# EAGLE design Adafruit Feather 32u4 Bluefruit LE (EAGLE 6.6.0)
COMPANY: ADAFRUIT INDUSTRIES; DRAWN: KTOWN; REV: B
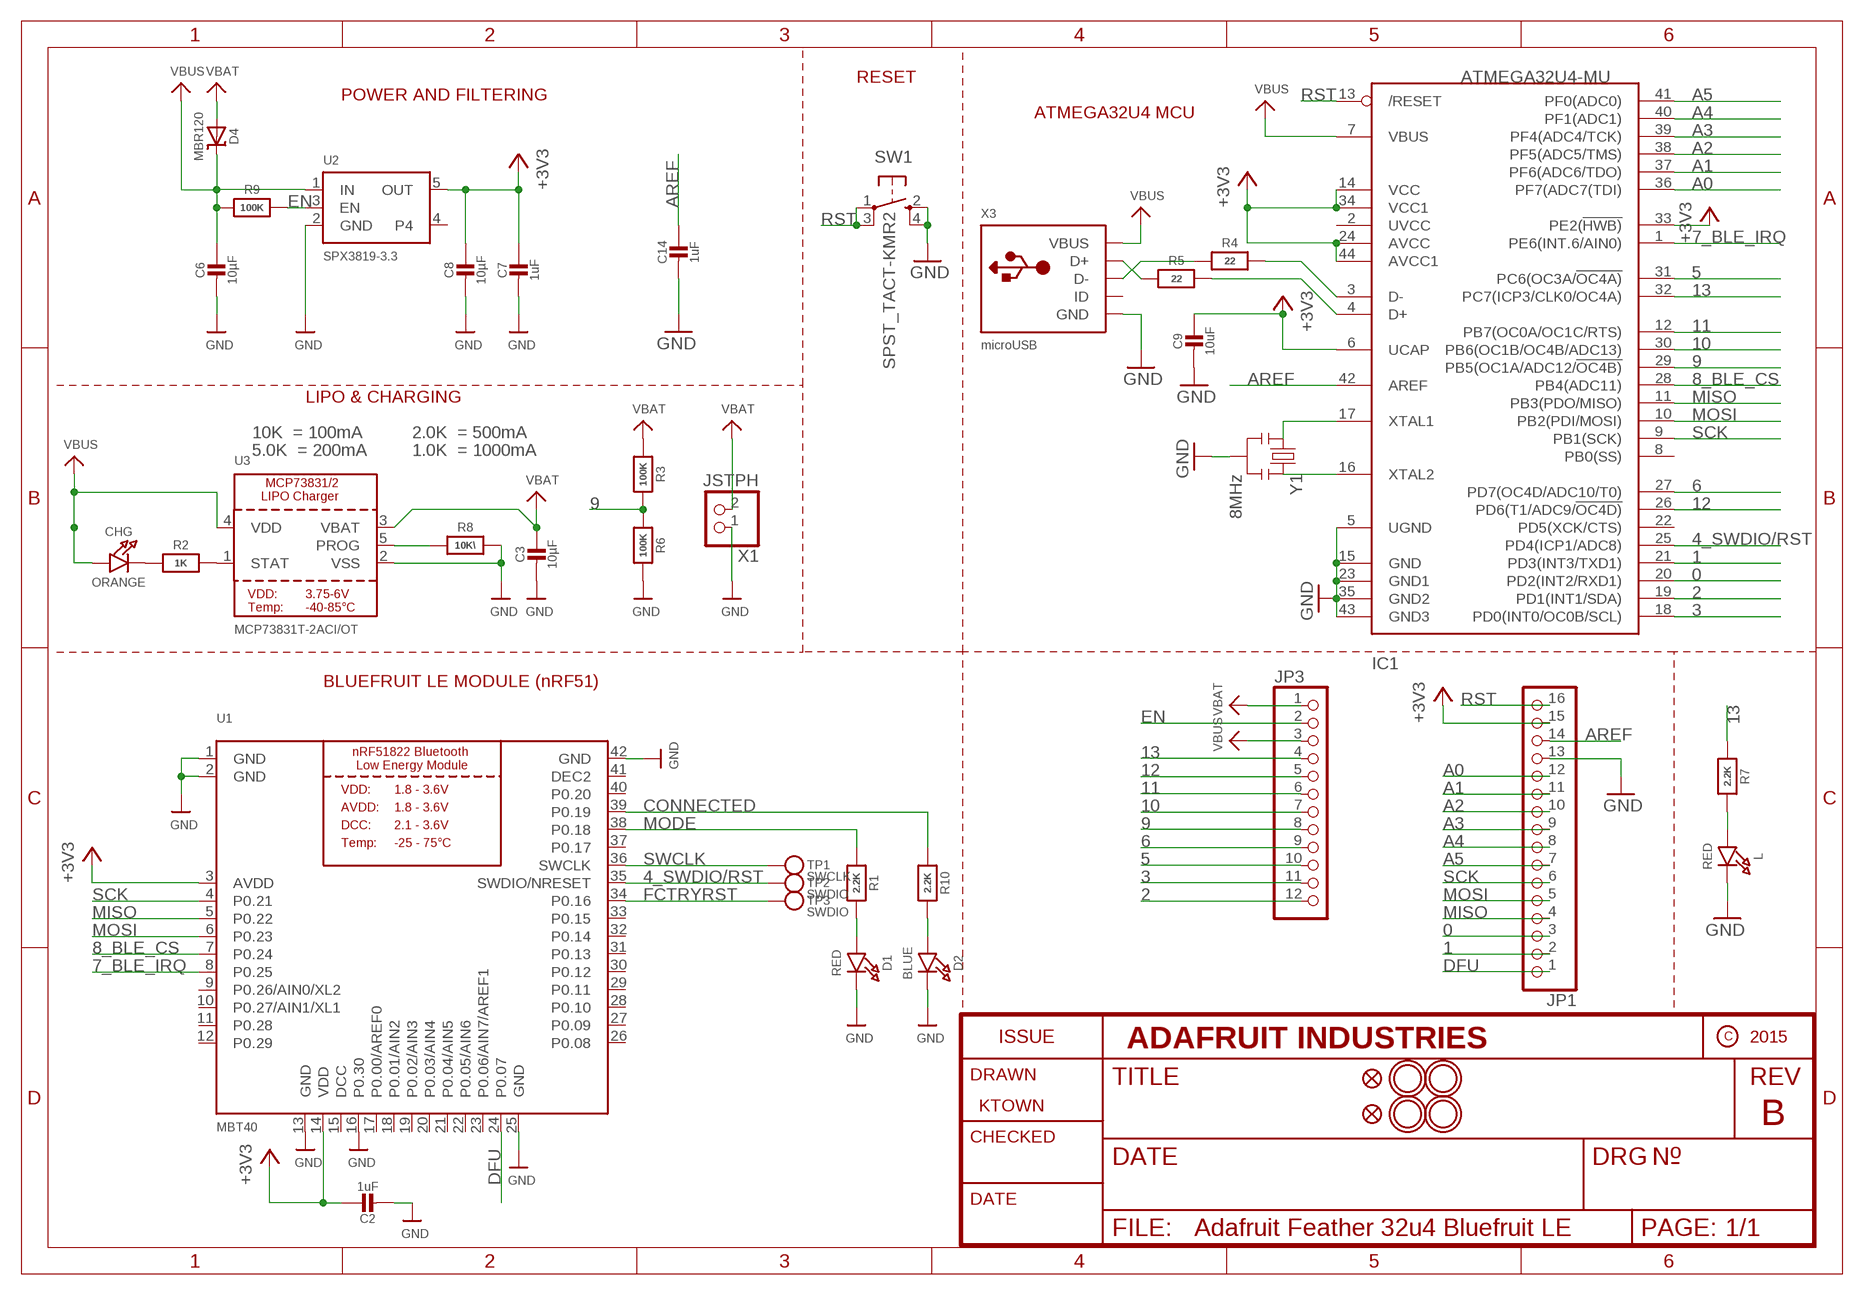
[diagram p0: schematic, sheet 1]

## Parts
C2  1uF  CAP_CERAMIC0603_NO  [0603-NO]
C3  10µF  CAP_CERAMIC0805-NOOUTLINE  [0805-NO]
C6  10µF  CAP_CERAMIC0805-NOOUTLINE  [0805-NO]
C7  1uF  CAP_CERAMIC0603_NO  [0603-NO]
C8  10µF  CAP_CERAMIC0805-NOOUTLINE  [0805-NO]
C9  10uF  CAP_CERAMIC_0805MP  [_0805MP]
C14  1uF  CAP_CERAMIC0603_NO  [0603-NO]
CHG  ORANGE  LED0805_NOOUTLINE  [CHIPLED_0805_NOOUTLINE]
D1  RED  LED0805_NOOUTLINE  [CHIPLED_0805_NOOUTLINE]
D2  BLUE  LED0805_NOOUTLINE  [CHIPLED_0805_NOOUTLINE]
D4  MBR120  DIODE-SCHOTTKYSOD-123  [SOD-123]
IC1  ATMEGA32U4-MU  [TQFN44_7MM]
JP1  HEADER-1X16ROUND  [1X16_ROUND]
JP3  HEADER-1X12  [1X12_ROUND]
L  RED  LED0805_NOOUTLINE  [CHIPLED_0805_NOOUTLINE]
R1  2.2K  RESISTOR_0603_NOOUT  [0603-NO]
R2  1K  RESISTOR_0603_NOOUT  [0603-NO]
R3  100K  RESISTOR_0603_NOOUT  [0603-NO]
R4  22  RESISTOR_0603_NOOUT  [0603-NO]
R5  22  RESISTOR_0603_NOOUT  [0603-NO]
R6  100K  RESISTOR_0603_NOOUT  [0603-NO]
R7  2.2K  RESISTOR_0603_NOOUT  [0603-NO]
R8  10K\  RESISTOR_0603_NOOUT  [0603-NO]
R9  100K  RESISTOR_0603_NOOUT  [0603-NO]
R10  2.2K  RESISTOR_0603_NOOUT  [0603-NO]
SW1  SPST_TACT-KMR2  [KMR2]
TP1  SWCLK  TESTPOINT1.5X2.0MM_NOCREAM  [PAD-1.5X2.0]
TP2  SWDIO  TESTPOINT1.5X2.0MM_NOCREAM  [PAD-1.5X2.0]
TP3  SWDIO  TESTPOINT1.5X2.0MM_NOCREAM  [PAD-1.5X2.0]
U1  MBT40  NRF51822_MODULE_MDBT40  [BLE_MODULE_RAYTAC_MDBT40]
U2  SPX3819-3.3  VREG_SOT23-5  [SOT23-5]
U3  MCP73831T-2ACI/OT  MCP73831/2  [SOT23-5]
U$6  MOUNTINGHOLE2.5  [MOUNTINGHOLE_2.5_PLATED]
U$24  MOUNTINGHOLE2.5  [MOUNTINGHOLE_2.5_PLATED]
U$31  MOUNTINGHOLE2.5  [MOUNTINGHOLE_2.5_PLATED]
U$32  MOUNTINGHOLE2.5  [MOUNTINGHOLE_2.5_PLATED]
U$34  FIDUCIAL""  [FIDUCIAL_1MM]
U$35  FIDUCIAL""  [FIDUCIAL_1MM]
X1  JSTPH  CON_JST_PH_2PIN  [JSTPH2]
X3  microUSB  USB_MICRO_20329_V2  [4UCONN_20329_V2]
Y1  8MHz  RESONATORSMD  [RESONATOR-SMD]

## Nets
0: IC1.20(PD2(INT2/RXD1)) JP1.3
1: IC1.21(PD3(INT3/TXD1)) JP1.2
2: IC1.19(PD1(INT1/SDA)) JP3.12
3: IC1.18(PD0(INT0/OC0B/SCL)) JP3.11
4_SWDIO/RST: IC1.25(PD4(ICP1/ADC8)) TP2.P$1 U1.35(SWDIO/NRESET)
5: IC1.31(PC6(OC3A/!OC4A)) JP3.10
6: IC1.27(PD7(OC4D/ADC10/T0)) JP3.9
7_BLE_IRQ: IC1.1(PE6(INT.6/AIN0)) U1.8(P0.25)
8_BLE_CS: IC1.28(PB4(ADC11)) U1.7(P0.24)
9: IC1.29(PB5(OC1A/ADC12/!OC4B)) JP3.8 R3.2 R6.1
10: IC1.30(PB6(OC1B/OC4B/ADC13)) JP3.7
11: IC1.12(PB7(OC0A/OC1C/RTS)) JP3.6
12: IC1.26(PD6(T1/ADC9/!OC4D)) JP3.5
13: IC1.32(PC7(ICP3/CLK0/OC4A)) JP3.4 R7.1
+3V3: C2.1 C7.1 C8.1 C9.1 IC1.6(UCAP) IC1.14(VCC) IC1.24(AVCC) IC1.33(PE2(!HWB)) IC1.34(VCC1) IC1.44(AVCC1) JP1.15 U1.3(AVDD) U1.14(VDD) U2.5(OUT)
A0: IC1.36(PF7(ADC7(TDI)) JP1.12
A1: IC1.37(PF6(ADC6/TDO)) JP1.11
A2: IC1.38(PF5(ADC5/TMS)) JP1.10
A3: IC1.39(PF4(ADC4/TCK)) JP1.9
A4: IC1.40(PF1(ADC1)) JP1.8
A5: IC1.41(PF0(ADC0)) JP1.7
AREF: C14.1 IC1.42(AREF) JP1.14
CONNECTED: R10.1 U1.39(P0.19)
D+: IC1.4(D+) R5.2
D-: IC1.3(D-) R4.2
DFU: JP1.1 U1.24(P0.07)
EN: JP3.2 R9.2 U2.3(EN)
FCTRYRST: TP3.P$1 U1.34(P0.16)
GND: C2.2 C3.2 C6.2 C7.2 C8.2 C9.2 C14.2 D1.C D2.C IC1.5(UGND) IC1.15(GND) IC1.23(GND1) IC1.35(GND2) IC1.43(GND3) JP1.13 L.C R6.2 R8.2 SW1.2(S) SW1.4(S1) U1.1(GND) U1.2(GND) U1.13(GND) U1.16(P0.30) U1.25(GND) U1.42(GND) U2.2(GND) U3.2(VSS) X1.1 X3.BASE@1(GND) X3.BASE@2(GND) X3.GND X3.SPRT@1(GND) X3.SPRT@2(GND) X3.SPRT@3(GND) X3.SPRT@4(GND) Y1.2
MISO: IC1.11(PB3(PDO/MISO)) JP1.4 U1.5(P0.22)
MODE: R1.1 U1.38(P0.18)
MOSI: IC1.10(PB2(PDI/MOSI)) JP1.5 U1.6(P0.23)
N$1: CHG.C R2.1
N$2: L.A R7.2
N$3: R2.2 U3.1(STAT)
N$4: R8.1 U3.5(PROG)
N$5: D1.A R1.2
N$6: D2.A R10.2
N$11: IC1.16(XTAL2) Y1.3
N$12: IC1.17(XTAL1) Y1.1
N$15: R5.1 X3.D+
N$16: R4.1 X3.D-
RST: IC1.13(/RESET) JP1.16 SW1.1(P) SW1.3(P1)
SCK: IC1.9(PB1(SCK)) JP1.6 U1.4(P0.21)
SWCLK: TP1.P$1 U1.36(SWCLK)
VBAT: C3.1 D4.A JP3.1 R3.1 U3.3(VBAT) X1.2
VBUS: C6.1 CHG.A D4.C IC1.7(VBUS) JP3.3 R9.1 U2.1(IN) U3.4(VDD) X3.VBUS
Unconnected: IC1.2(UVCC) IC1.8(PB0(SS)) IC1.22(PD5(XCK/CTS)) U1.9(P0.26/AIN0/XL2) U1.10(P0.27/AIN1/XL1) U1.11(P0.28) U1.12(P0.29) U1.17(P0.00/AREF0) U1.18(P0.01/AIN2) U1.19(P0.02/AIN3) U1.20(P0.03/AIN4) U1.21(P0.04/AIN5) U1.22(P0.05/AIN6) U1.23(P0.06/AIN7/AREF1) U1.26(P0.08) U1.27(P0.09) U1.28(P0.10) U1.29(P0.11) U1.30(P0.12) U1.31(P0.13) U1.32(P0.14) U1.33(P0.15) U1.37(P0.17) U1.40(P0.20) U2.4 X3.ID

## Notes on the sheet
- RESET
- POWER AND FILTERING
- ATMEGA32U4 MCU
- LIPO & CHARGING
- 10K  = 100mA | 2.0K  = 500mA
- 5.0K  = 200mA | 1.0K  = 1000mA
- BLUEFRUIT LE MODULE (nRF51)

## Power pins joined to a net without a drawn wire
DCC: U1.15(DCC)
DEC2: U1.41(DEC2)

## Library data of the parts
C2 C3 C6-C9 C14 = microbuilder:CAP_CERAMIC: Ceramic Capacitors For new designs, use the packages preceded by an '_' character since they are more reliable: The following footprints should be used on most boards: _0402 - Standard footprint for regular board layouts _0603 - Standard footprint for regular board layouts _0805 - Standard footprint for regular board layouts _1206 - Standard footprint for regular board layouts For extremely tight-pitch boards where space is at a premium, the following 'micro-pitch' footprints can be used (smaller pads, no silkscreen outline, etc.): _0402MP - Micro-pitch footprint for very dense/compact boards _0603MP - Micro-pitch footprint for very dense/compact boards _0805MP - Micro-pitch footprint for very dense/compact boards _1206MP - Micro-pitch footprint for very dense/compact boards
CHG D1 D2 L = microbuilder:LED: LED 0603 - 0603 Surface Mount Package 2mA: Green LED - Low Power (3.9mcd, 2ma, 1.7Vf) - Digikey: 475-2709-2-ND Orange LED - Low Power (9.8mcd, 2ma, 1.8Vf) - Digikey: 475-1194-2-ND Red LED - Low Power (5mcd, 2ma, 1.8Vf) - Digikey: 475-1195-2-ND Yellow LED - Low Power (7mcd, 2ma, 1.8Vf) - Digikey: 475-1196-2-ND 5mA: Blue LED - Low Power (17mcd, 5ma, 2.9Vf) - Digikey: LNJ937W8CRACT-ND 0805 - 0805 Surface Mount Package 2mA: Red LED (8.8mcd, 2mA, 1.8Vf, Clear) - Low Power [Digikey: 475-2510-1-ND] Green LED (5mcd, 2mA, 1.8Vf, Clear) - Low Power [Digikey: 475-2730-1-ND] Yellow LED (11.3mcd, 2mA, 1.8Vf, Clear) - Low Power [Digikey: 475-2555-1-ND] 20mA: Red LED (104mcd, 20mA, Diffused) - LS R976 [Digikey: 475-1278-6-ND] Red LED (12mcd, 20mA, 2.0Vf, Clear) - APT2012EC [Digikey: 754-1128-1-ND] Green LED (15mcd, 20mA, 2.2Vf, Clear) - APT2012GC [Digikey: 754-1131-1-ND] Orange LED (160mcd, 20mA, 2.1Vf, Clear) - APT2012SECK [Digikey: 754-1130-1-ND] 1206 - 1206 Surface Mount Package Green LED (26mcd, 20mA, Diffused) - LG N971 [Digikey: 475-1407-6-ND] Red LED (15mcd, 20mA, Diffused) - LH N974 [Digikey: 475-1416-6-ND] Cree - Cree High-Power Surface Mount LEDs XPEBWT-L1-0000-00D50 - White 111lm 350mA 2.9Vf 6200K 110° XTEAWT-00-0000-00000LEE3 - White 114lm 350mA 2.85Vf 5000K 115° Everlight - Everlight 45-21 Series Surface Mount LEDs 45-21/QK2C-B2832AC2CB2/2T - Warm White 2000mcd 20mA 3.25Vf 3050K 120° 45-21/LK2C-B38452C4CB2/2T - Nuetral White 2000mcd 20mA 3.25Vf 4150K 120° 45-21/LK2C-B50634C6CB2/2T - Cold White 2200mcd 20mA 3.25Vf 5650K 120° PLCC2 Reverse Mount LS T77K-J1L2-1-0-2-R18-Z - Red 11.25mcd 2mA 1.8Vf 630nm 120° LO T77K-L1M2-24-Z - Orange 19.6mcd 2mA 1.8Vf 606nm 120° LY T77K-K2M1-26-Z - Yellow 15.7mcd 2mA 1.8Vf 587nm 120°
D4 = microbuilder:DIODE-SCHOTTKY
IC1 = microbuilder:ATMEGA32U4: http://www.ladyada.net/library/eagle
JP1 = microbuilder:HEADER-1X16: PIN HEADER
JP3 = microbuilder:HEADER-1X12
R1-R10 = microbuilder:RESISTOR: Resistors For new designs, use the packages preceded by an '_' character since they are more reliable: The following footprints should be used on most boards: _0402 - Standard footprint for regular board layouts _0603 - Standard footprint for regular board layouts _0805 - Standard footprint for regular board layouts _1206 - Standard footprint for regular board layouts For extremely tight-pitch boards where space is at a premium, the following 'micro-pitch' footprints can be used (smaller pads, no silkscreen outline, etc.): _0402MP - Micro-pitch footprint for very dense/compact boards _0603MP - Micro-pitch footprint for very dense/compact boards _0805MP - Micro-pitch footprint for very dense/compact boards _1206MP - Micro-pitch footprint for very dense/compact boards
SW1 = adafruit:SPST_TACT: SMT 6mm switch, EVQQ2 series http://www.ladyada.net/library/eagle
TP1-TP3 = microbuilder:TESTPOINT: Test Point Various test points for characterisation and PCB testing TESTPOINT_SMT - Compact Surface Mount Test Point [Digikey: 5016KTR-ND]
U1 = microbuilder:NRF51822_MODULE_MDBT40: nRF51822 Bluetooth Low Energy Module
U2 = microbuilder:VREG_SOT23-5: SOT23-5 Fixed Voltage Regulators Part Current Out V Out V In V Dropout θJA (°C/W) TJ (°C) Digikey Part No. ADP121 150mA 3.3V 3.4-5.5V 0.09V @ 150mA -- -- ADP121-AUJZ33R7CT-ND ADP121 150mA 3.0V 3.1-5.5V 0.09V @ 150mA -- -- ADP121-AUJZ30R7CT-ND ADP122 300mA 3.3V 3.4-5.5V 0.085V @ 300mA -- -- ADP122AUJZ-3.3-R7CT-ND ADP1712 300mA 3.3V 3.5-5.5V 0.17V @ 300mA -- -- ADP1712AUJZ-3.3-R7TR-ND AP7311 (Low Cost) 150mA 3.3V 3.5-6V 0.15V @ 150mA -- -- AP7311-33WG-7DICT-ND LD39015M18R 150mA 1.8V 1.9V-5.5V 0.08V @ 100mA -- -- 497-6977-1-ND LP2985A-33DBVR 150mA 3.3V 3.3-16V 0.28V @ 150mA 206 150 296-18479-1-ND MCP1824T-3302E/OT 300mA 3.3V 3.5V-6V 0.2V @ 300mA -- -- MCP1824T-3302E/OTCT-ND MIC5205-2.5YM5 TR 150mA 2.5V 2.7-16V 0.165V @ 150mA -- -- 576-1257-2-ND MIC5205-3.0YM5 TR 150mA 3.0V 3.2V-16V 0.165V @ 150mA -- -- 576-1258-2-ND MIC5205-3.3YM5 TR 150mA 3.3V 3.5V-16V 0.165V @ 150mA -- -- 576-1259-2-ND TPS780330220 150mA 3.3V+2.2V 3.6-5.5V 250mV Max -- -- 296-23332-1-ND TDA3663/N1,135 100mA 3.3V 3.5-45V 0.18V @ 50mA -- -- 568-5343-1-ND Max operating temp can be calculated using θJA, TJ (max junction temperature), and power in watts. Set the "Maximum Ambient Temperature" until it reaches TJ ("Max Junction Temperature"), which is the absolute limit for safe use of the regulator: Heat Sink Temperature Calculator <http://www.daycounter.com/Calculators/Heat-Sink-Temperature-Calculator.phtml> For example, With 12V source into a 3.3V LP2985 and a 30mA load, we are dissipating (12V-3.3V) * 0.03A = 0.261W. With a θJA of 206 °C/W, a TJ of 150°C, and 261mW we can safely use the chip without a heat sink up to 75°C (=147.1°C Junction Temperature).
U3 = microbuilder:MCP73831/2: MCP73831/2 LIPO Charger VDD: 3.75 - 6V Temp -40 - 85°C Programmable Charge Rate: 15-500mA NOTE: STAT is a tri-state logic output on the MCP73831 and an open-drain output on the MCP73832. SOT23-5 with 4.2V output and tri-state logic on STAT = MCP73831T-2ACI/OT
U$6 U$24 U$31 U$32 = microbuilder:MOUNTINGHOLE: Mounting Hole For #2 screws (0.086"/2.18mm width, 0.094"/2.4mm hole) use 2.5mm; BOM: EXCLUDE
U$34 U$35 = microbuilder:FIDUCIAL: Fiducial Alignment Points Various fiducial points for machine vision alignment.; BOM: EXCLUDE
X1 = microbuilder:CON_JST_PH_2PIN: JST 2-Pin Right-Angle Connector PH-Series - 4UConnector: 17311 SH-Series - 4UConnector: 07278
X3 = microbuilder:USB: USB Connectors USBMINIB - Surface Mount Female Mini-B USB Connector 4UConnector: 06564
Y1 = SparkFun:RESONATOR: Resonator Small SMD resonator. This is the itty bitty 10/20MHz resonators with built in caps. CSTCE10M0G55 and CSTCE20M0V53. Footprint has been reviewed closely but hasn't been tested yet.

## Board
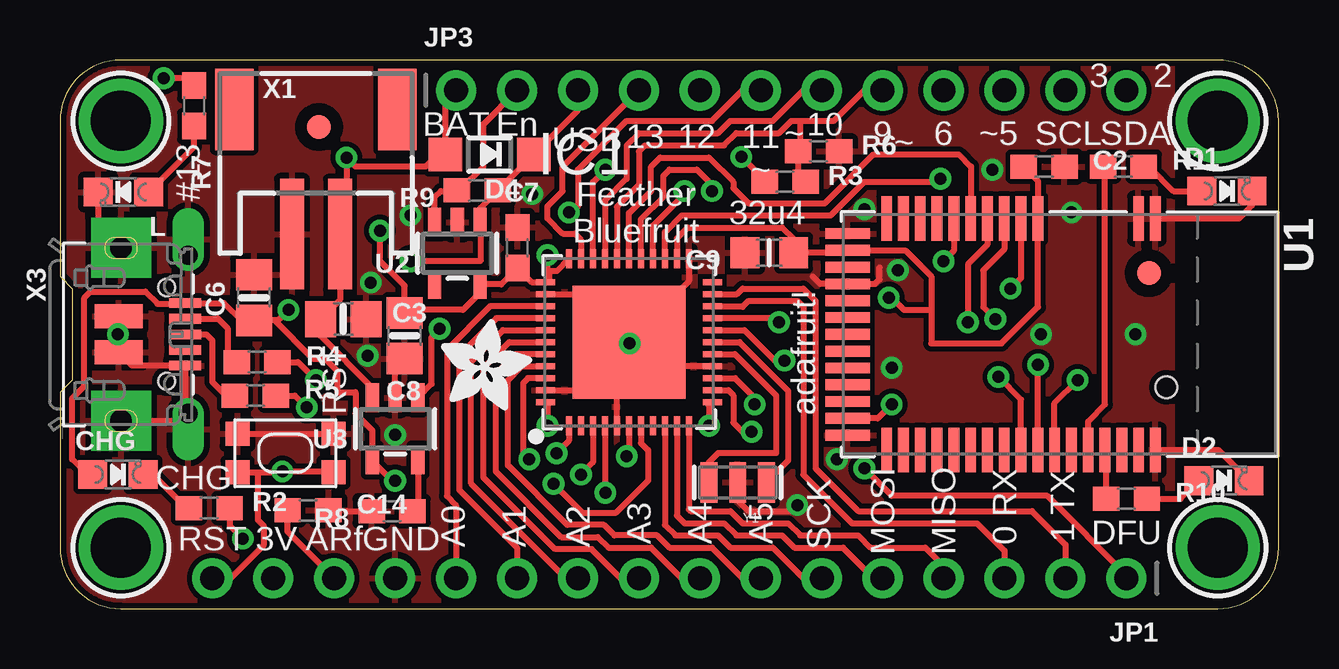
[diagram p1: board, top side]
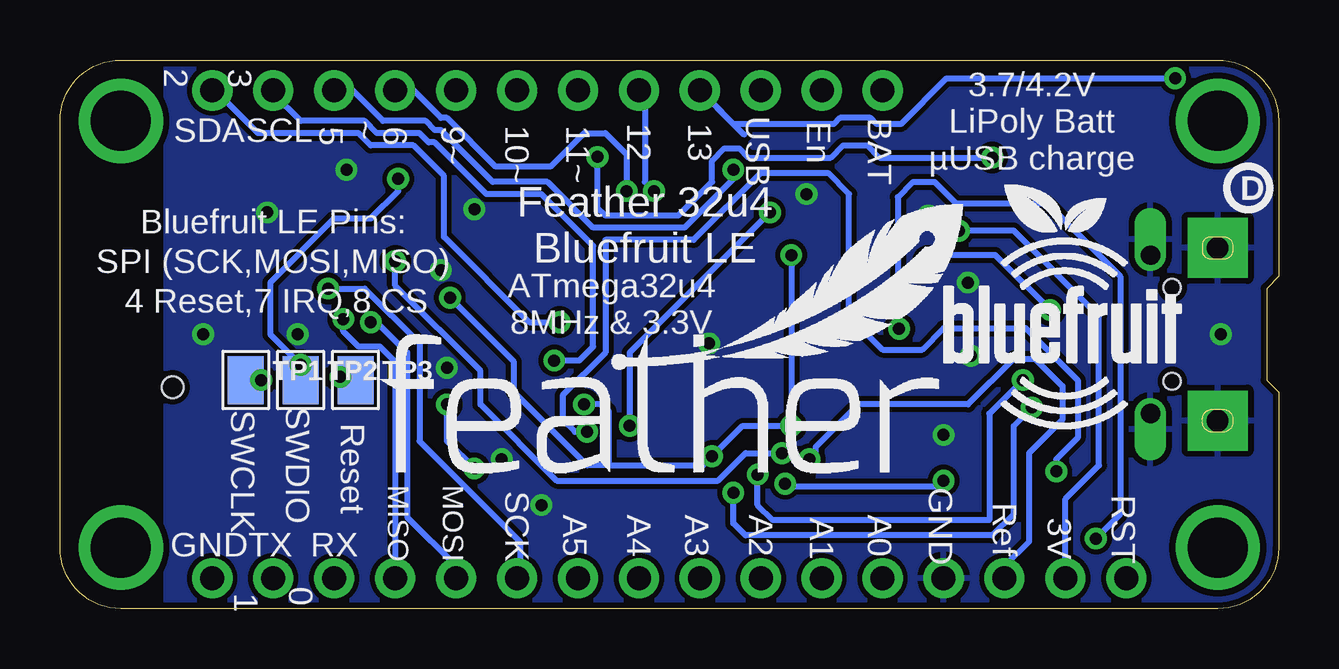
[diagram p2: board, bottom side, seen from below]

Size 50.8 x 22.86 mm. Coordinates in mm from the lower left corner, seen from the top.
Outline: 2.54,0 48.26,0 arc90 50.8,2.54 50.8,20.32 arc90 48.26,22.86 2.54,22.86 arc90 0,20.32 0,13.84 0.51,13.34 0.51,9.53 0,9.02 0,2.54 arc90 2.54,0
Copper layers (1*16): Top 0.035mm / dielectric 1.5mm / Bottom 0.035mm
Design rules "adafruit *": minimum track width 8mil, minimum drill 15.5mil, track to track 8mil, track to pad 8mil, pad to pad 8mil, via to via 8mil, smd to smd 8mil, copper to edge 10mil, drill to drill 8mil, minimum pad ring 10mil, minimum via ring 8mil, stop-mask expansion 2mil, vias tented up to drill 20mil, thermal gap 10mil
tRestrict: area 23.4,8.3 to 26.5,8.6; area 26.2,8.4 to 26.7,9.9; area 21.2,13.6 to 25.9,14.1; area 20.8,13.3 to 21.2,13.7; area 20.7,9.3 to 21.2,13; area 20.7,8.1 to 21.2,8.9; area 21.1,8.1 to 23,8.6; area 26.2,10.3 to 26.7,13.3

### Footprints (pad centres in the part's own frame; a part is rotated, then mirrored left to right if it is on the bottom)
0603-NO = smd 1.1 x 1: 1 -0.85,0; 2 0.85,0
0805-NO = smd 1.3 x 1.5: 1 -0.95,0; 2 0.95,0
_0805MP = smd 1.2 x 1.3: 1 -1.016,0; 2 1.016,0
CHIPLED_0805_NOOUTLINE = smd 1.2 x 1.2: A 0,-1.05; C 0,1.05
SOD-123 = smd 1.4 x 1.4: A 1.85,0; C -1.85,0
TQFN44_7MM = smd 0.25 x 0.8: 1 -2.5,-3.475; 2 -2,-3.475; 3 -1.5,-3.475; 4 -1,-3.475; 5 -0.5,-3.475; 6 0,-3.475; 7 0.5,-3.475; 8 1,-3.475; 9 1.5,-3.475; 10 2,-3.475; 11 2.5,-3.475; 23 2.5,3.475; 24 2,3.475; 25 1.5,3.475; 26 1,3.475; 27 0.5,3.475; 28 0,3.475; 29 -0.5,3.475; 30 -1,3.475; 31 -1.5,3.475; 32 -2,3.475; 33 -2.5,3.475 | smd 0.8 x 0.25: 12 3.475,-2.5; 13 3.475,-2; 14 3.475,-1.5; 15 3.475,-1; 16 3.475,-0.5; 17 3.475,0; 18 3.475,0.5; 19 3.475,1; 20 3.475,1.5; 21 3.475,2; 22 3.475,2.5; 34 -3.475,2.5; 35 -3.475,2; 36 -3.475,1.5; 37 -3.475,1; 38 -3.475,0.5; 39 -3.475,0; 40 -3.475,-0.5; 41 -3.475,-1; 42 -3.475,-1.5; 43 -3.475,-2; 44 -3.475,-2.5 | smd 4.7 x 4.7: THERMAL 0,0
1X16_ROUND = drill 1 pad 1.676: 1 -19.05,0; 2 -16.51,0; 3 -13.97,0; 4 -11.43,0; 5 -8.89,0; 6 -6.35,0; 7 -3.81,0; 8 -1.27,0; 9 1.27,0; 10 3.81,0; 11 6.35,0; 12 8.89,0; 13 11.43,0; 14 13.97,0; 15 16.51,0; 16 19.05,0
1X12_ROUND = drill 1 pad 1.676: 1 -13.97,0; 2 -11.43,0; 3 -8.89,0; 4 -6.35,0; 5 -3.81,0; 6 -1.27,0; 7 1.27,0; 8 3.81,0; 9 6.35,0; 10 8.89,0; 11 11.43,0; 12 13.97,0
KMR2 = smd 1 x 1: 1 2,0.8; 2 2,-0.8; 3 -2,0.8; 4 -2,-0.8
PAD-1.5X2.0 = smd 1.5 x 2: P$1 0,0
BLE_MODULE_RAYTAC_MDBT40 = smd 1.85 x 0.45: 1 -4.825,4; 2 -4.825,3.3; 3 -4.825,-0.9; 4 -4.825,-1.6; 5 -4.825,-2.3; 6 -4.825,-3; 7 -4.825,-3.7; 8 -4.825,-4.4; 9 -4.825,-5.1; 10 -4.825,-5.8; 11 -4.825,-6.5; 12 -4.825,-7.2; 26 4.825,-7.2; 27 4.825,-6.5; 28 4.825,-5.8; 29 4.825,-5.1; 30 4.825,-4.4; 31 4.825,-3.7; 32 4.825,-3; 33 4.825,-2.3; 34 4.825,-1.6; 35 4.825,-0.9; 36 4.825,-0.2; 37 4.825,0.5; 38 4.825,1.2; 39 4.825,1.9; 40 4.825,2.6; 41 4.825,3.3; 42 4.825,4 | smd 0.45 x 1.85: 13 -4.2,-8.825; 14 -3.5,-8.825; 15 -2.8,-8.825; 16 -2.1,-8.825; 17 -1.4,-8.825; 18 -0.7,-8.825; 19 0,-8.825; 20 0.7,-8.825; 21 1.4,-8.825; 22 2.1,-8.825; 23 2.8,-8.825; 24 3.5,-8.825; 25 4.2,-8.825 | hole 0.9: 2.2,4.45
SOT23-5 = smd 0.55 x 1.2: 1 -0.95,-1.3; 2 0,-1.3; 3 0.95,-1.3; 4 0.95,1.3; 5 -0.95,1.3
MOUNTINGHOLE_2.5_PLATED = drill 2.5 pad 3.2: P$1 0,0
FIDUCIAL_1MM = smd 1 x 1: 1 0,0
JSTPH2 = smd 1 x 4.6: 1 -1,-3.7; 2 1,-3.7 | smd 1.6 x 3.4: NC1 -3.4,1.5; NC2 3.4,1.5
4UCONN_20329_V2 = smd 1 x 2: BASE@1 -0.75,-2; BASE@2 0.75,-2 | smd 0.4 x 1.35: D+ 0,0.775; D- -0.65,0.775; GND 1.3,0.775; ID 0.65,0.775; VBUS -1.3,0.775 | drill 0.8 pad 1.2 offset: SPRT@1 -3.3,0.9; SPRT@2 3.3,0.9 | drill 0.9 pad 2.5 square: SPRT@3 -3.6,-1.9; SPRT@4 3.6,-1.9 | hole 0.7: -1.95,0; 1.95,0
RESONATOR-SMD = smd 0.7 x 1.7: 1 -1.2,0; 2 0,0; 3 1.2,0

### Placement (x,y rotation side)
C2  41.02,18.41 0 top
C3  11.81,12.06 0 top
C6  8.09,12.96 90 top
C7  19.07,15.04 90 top
C8  14.37,11.37 270 top
C9  29.57,14.83 180 top
C14  10.34,4.09 0 top
CHG  2.41,5.59 270 top
D1  48.64,17.4 270 top
D2  48.51,5.33 270 top
D4  17.91,18.92 180 top
IC1  23.72,11.1 0 top
JP1  25.4,1.27 180 top
JP3  30.48,21.59 0 top
L  2.65,17.36 90 top
R1  44.32,18.41 0 top
R2  6.22,4.19 0 top
R3  30.23,17.78 0 top
R4  8.22,10.27 0 top
R5  8.15,8.88 0 top
R6  31.62,19.05 0 top
R7  5.59,20.95 270 top
R8  13.84,4.06 180 top
R9  17.4,17.42 180 top
R10  44.45,4.57 0 top
SW1  9.4,6.48 180 top
TP1  43.05,9.53 0 bottom
TP2  40.77,9.53 0 bottom
TP3  38.48,9.53 0 bottom
U1  41.66,11.43 270 top
U2  16.56,14.81 180 top
U3  13.97,7.49 180 top
U$6  48.26,20.32 0 top
U$7  [ADAFRUIT_3.5MM]  15.88,8.26 0 top
U$9  [FEATHERLOGO]  37.47,5.59 0 bottom
U$23  [PCBFEAT-REV-040]  1.27,17.53 0 bottom
U$24  48.26,2.54 0 top
U$26  [BLUEFRUITLOGO_100MM]  13.97,7.49 0 bottom
U$31  2.54,20.32 270 top
U$32  2.54,2.54 270 top
U$34  10.79,20.07 270 top
U$35  45.39,13.98 270 top
X1  10.67,19.3 0 top
X3  4.45,11.43 270 top
Y1  28.25,5.26 180 top

### Tracks (layer width: path | path; a pad name or v marks a point on that pad's centre or on a via)
0
  Top 0.254: JP1.3 39.37,2.41 38.23,3.56 33.02,3.56 30.99,5.59 30.99,12.57 30.73,12.83 28.7,12.83 28.45,12.57 27.22,12.57 IC1.20
1
  Top 0.254: JP1.2 41.91,2.67 40.51,4.06 33.27,4.06 31.5,5.84 31.5,12.83 30.99,13.34 28.45,13.34 28.21,13.1 IC1.21
2  (via drill 0.5)
  Top 0.254: IC1.19 29.75,12.1 29.92,11.94 v29.97,11.94
  Bottom 0.254: 43.94,21.59 JP3.12 44.32,21.59 42.55,19.81 38.35,19.81 37.85,19.3 36.07,19.3 34.8,18.03 34.8,15.49 31.24,11.94 v29.97,11.94
3  (via drill 0.5)
  Top 0.254: IC1.18 28.53,11.6 29.79,10.34 v30.2,10.34
  Bottom 0.254: JP3.11 41.91,21.46 40.77,20.32 38.1,20.32 37.59,19.81 35.81,19.81 35.43,19.43 35.18,19.43 33.02,17.27 30.73,17.27 28.57,15.11 28.57,10.92 29.16,10.34 v30.2,10.34
4_SWDIO/RST  (via drill 0.5)
  Top 0.254: U1.35 40.76,10.15 v40.77,10.16 | IC1.25 25.22,15.69 25.91,16.38 32.13,16.38 33.53,17.78 36.58,17.78 v36.7,17.91
  Bottom 0.254: TP2.P$1 v40.77,10.16 42.04,11.43 42.04,13.59 39.37,16.26 37.85,16.26 36.7,17.4 v36.7,17.91
5  (via drill 0.5)
  Top 0.254: IC1.31 22.22,17.77 v22.73,18.29
  Bottom 0.254: JP3.10 39.12,21.59 | 39.5,21.59 JP3.10 | v22.73,18.29 22.73,17.91 24.77,15.88 28.57,15.88 30.48,17.78 32.77,17.78 34.92,19.94 35.18,19.94 35.56,20.32 37.34,20.32 38.61,21.59 JP3.10
6  (via drill 0.5)
  Top 0.254: IC1.27 24.22,16.22 25.15,17.14 25.15,18.03 25.4,18.29 26.54,18.29 27.18,17.65 v27.18,17.4
  Bottom 0.254: JP3.9 36.07,21.59 34.92,20.45 34.67,20.45 32.64,18.41 30.35,18.41 28.96,19.81 28.07,19.81 27.18,18.92 v27.18,17.4
7_BLE_IRQ  (via drill 0.5)
  Top 0.254: U1.8 37.26,14.9 v36.83,14.48 | IC1.1 21.22,6.99 v20.7,6.48
  Bottom 0.254: v20.7,6.48 22.23,6.48 23.37,5.33 30.1,5.33 33.27,8.51 33.27,9.91 36.83,13.46 v36.83,14.48
8_BLE_CS
  Top 0.254: IC1.28 23.72,16.48 24.64,17.4 24.64,18.41 25.02,18.8 27.05,18.8 28.07,17.78 28.07,17.53 28.7,16.89 31.88,16.89 33.91,18.92 37.47,18.92 37.97,18.41 37.97,16.27 U1.7
9
  Top 0.254: IC1.29 23.22,16.74 24.13,17.65 24.13,19.05 24.38,19.3 27.69,19.3 28.19,19.81 29.97,19.81 30.48,20.32 30.86,20.32 | 30.86,20.32 32.26,20.32 33.53,21.59 JP3.8 | R3.2 30.77,18.08 R6.1 30.86,19.14 30.86,20.32
10
  Top 0.254: JP3.7 30.99,21.59 29.72,20.32 27.94,20.32 27.43,19.81 24.13,19.81 23.62,19.3 23.62,17.91 22.72,17 IC1.30
11  (via drill 0.5)
  Top 0.254: v21.21,16.51 21.34,16.51 21.59,16.76 21.59,18.29 23.62,20.32 27.18,20.32 28.45,21.59 JP3.6 | IC1.12 27.05,8.46 v27.05,7.62
  Bottom 0.254: v21.21,16.51 27.05,10.67 v27.05,7.62
12  (via drill 0.5)
  Top 0.254: v26.04,17.4 26.16,17.4 24.72,15.96 IC1.26
  Bottom 0.254: JP3.5 26.42,21.34 26.42,17.78 v26.04,17.4
13  (via drill 0.5)
  Top 0.254: JP3.4 20.95,18.41 20.95,17.4 20.32,16.76 20.32,16.26 20.95,15.62 21.46,15.62 21.72,15.37 IC1.32 | R7.1 5.29,22.1 v4.32,22.1
  Bottom 0.254: 22.29,19.75 JP3.4 22.73,20.19 18.54,20.19 18.29,20.45 17.02,20.45 16.76,20.19 15.75,20.19 13.84,22.1 v4.32,22.1
+3V3  (via drill 0.5)
  Top 0.254: 36.32,12.45 36.32,13.84 35.23,14.93 U1.14 32.8,14.96 32.68,14.83 C9.1 30.59,15.39 30.1,15.88 26.16,15.88 25.72,15.43 IC1.24 | 36.32,12.45 36.32,11.05 39.24,11.05 40.77,12.57 40.77,15.61 40.76,15.62 U1.3 40.76,17.83 C2.1 | IC1.33 20.71,14.07 20.39,14.07 | 20.39,14.07 20.32,14.14 v20.32,14.73 | IC1.14 28.14,9.6 28.96,8.79 v28.96,8.51 | 36.32,12.45 35.18,12.45 34.67,12.95 v34.54,12.95 | 20.39,14.07 20.39,13.6 IC1.34 19.65,13.6 C7.1 18.39,13.51 U2.5 17.51,13.16 16.8,12.45 14.49,12.45 C8.1 14.37,13.45 13.34,14.48 v13.34,15.75 | IC1.44 20.32,8.53 v20.32,7.62 | IC1.6 23.72,6.45 v23.62,6.35
  Bottom 0.254: v20.32,14.73 v20.32,7.62 22.35,7.62 v23.62,6.35 24,5.97 27.94,5.97 | 27.94,5.97 27.94,8.26 28.19,8.51 v28.96,8.51 | 27.94,5.97 28.83,5.97 31.88,9.02 31.88,10.29 v34.54,12.95 | JP1.15 8.89,4.57 7.49,5.97 7.49,12.19 11.05,15.75 v13.34,15.75
A0
  Top 0.254: IC1.36 17.94,12.6 16.13,10.79 16.13,4.7 16.51,4.32 JP1.12
A1
  Top 0.254: IC1.37 18.2,12.1 16.64,10.54 16.64,4.95 19.05,2.54 JP1.11
A2
  Top 0.254: JP1.10 21.08,1.27 17.14,5.21 17.14,10.29 18.46,11.6 IC1.38
A3
  Top 0.254: JP1.9 23.37,1.27 22.16,2.48 20.64,2.48 17.65,5.46 17.65,10.03 18.72,11.1 IC1.39
A4
  Top 0.254: IC1.40 18.98,10.6 18.16,9.78 18.16,5.71 20.89,2.98 22.42,2.98 22.86,2.54 24.64,2.54 25.91,1.27 JP1.8
A5
  Top 0.254: IC1.41 19.25,10.1 18.67,9.53 18.67,5.97 21.14,3.49 22.67,3.49 23.11,3.05 24.89,3.05 25.4,2.54 27.18,2.54 28.45,1.27 JP1.7
AREF  (via drill 0.5)
  Top 0.254: IC1.42 19.51,9.6 19.3,9.4 19.3,6.48 v19.56,6.22 | JP1.14 9.49,3.21 C14.1
  Bottom 0.254: JP1.14 11.43,1.78 10.41,2.79 10.41,6.48 9.02,7.87 9.02,9.27 10.16,10.41 11.05,10.41 12.95,8.51 17.53,8.51 19.3,6.73 19.3,6.48 v19.56,6.22
CONNECTED
  Top 0.254: U1.39 43.5,6.55 43.6,6.45 R10.1
D+  (via drill 0.5)
  Top 0.254: IC1.4 22.72,4.84 v22.73,4.83 | R5.2 9.79,8.88 v10.29,8.38
  Bottom 0.254: v10.29,8.38 11.05,7.62 11.05,3.94 11.94,3.05 22.23,3.05 22.73,3.56 v22.73,4.83
D-  (via drill 0.5)
  Top 0.254: IC1.3 22.22,6.09 v21.72,5.59 | R4.2 9.93,10.27 v10.67,9.53
  Bottom 0.254: v10.67,9.53 12.06,8.13 12.06,3.68 21.08,3.68 21.72,4.32 v21.72,5.59
DFU  (via drill 0.5)
  Top 0.254: JP1.1 44.45,1.4 41.15,4.7 34.67,4.7 v33.53,5.84 | v34.67,8.51 34.09,7.93 U1.24
  Bottom 0.254: v33.53,5.84 34.67,6.99 v34.67,8.51
EN
  Top 0.254: U2.3 15.61,17.14 15.88,17.4 16.52,17.4 R9.2 16.66,17.42 17.65,18.41 17.65,20.19 JP3.2
FCTRYRST  (via drill 0.5)
  Top 0.254: U1.34 40.06,8.71 v39.12,9.65
  Bottom 0.254: v39.12,9.65 38.61,9.65 TP3.P$1
GND  (via drill 0.5)
  Top 0.254: D1.C 49.69,16.8 49.15,16.25 U1.1 | D2.C 48.29,6.61 U1.42 | IC1.15 25.08,10.1 23.88,11.3 | IC1.5 23.22,10.52 v23.75,11.05 | IC1.43 22.31,9.1 22.31,9.61 v23.75,11.05 | IC1.35 22.08,13.1 23.88,11.3 | 34.16,14.22 34.16,13.72 33.98,13.53 U1.16 31.68,13.53 31.37,13.84 | 32.89,15.69 U1.13 | IC1.23 26.22,13.64 23.88,11.3 | L.C 1.59,15.03 X3.SPRT@3 | X3.BASE@2 3,10.13 X3.GND 5.22,8.26 X3.SPRT@2 5.04,7.83 X3.SPRT@4 | SW1.2 SW1.4 | 11.98,4.06 R8.2 | 23.88,11.3 23.88,11.18 v23.75,11.05 | U3.2 13.97,9.91 14.35,10.29 | Y1.2 28.25,4.52 28.7,4.06 30.61,4.06
  other vias: 44.83,11.43 42.16,16.51 34.92,14.1 33.53,16.64 38.86,18.29 32.38,6.22 34.67,10.03 2.41,11.43 12.95,13.59 19.68,17.27 12.83,10.54 13.97,7.24 40.89,11.43 14.61,16.38 30.73,4.32
  pour Top: -0.25,23.24 -0.25,-0.25 46.35,0 46.35,22.86
  pour Bottom: -0.13,0.25 46.35,0 46.35,22.86 -0.25,23.11
MISO  (via drill 0.5)
  Top 0.254: JP1.4 36.83,1.78 36.07,2.54 33.78,2.54 33.27,3.05 30.86,3.05 30.35,3.56 28.45,3.56 27.94,4.06 26.29,4.06 26.22,4.13 IC1.11 | U1.5 39.36,14.97 38.48,14.1 38.48,12.57 v38.99,12.06
  Bottom 0.254: JP1.4 36.83,10.29 37.47,10.92 38.35,10.92 38.99,11.56 v38.99,12.06
MODE
  Top 0.254: U1.38 42.86,7.8 43.56,8.51 43.56,18.33 R1.1
MOSI  (via drill 0.5)
  Top 0.254: JP1.5 33.91,1.27 32.64,2.54 30.61,2.54 30.1,3.05 28.19,3.05 27.69,3.56 26.04,3.56 25.72,3.87 IC1.10 | U1.6 38.66,15.16 37.85,14.35 v37.85,11.94
  Bottom 0.254: JP1.5 34.29,1.78 36.32,3.81 36.32,10.67 37.59,11.94 v37.85,11.94
N$1
  Top 0.254: CHG.C 3.88,5.59 5.27,4.19 R2.1
N$2
  Top 0.254: L.A 5.59,19.25 R7.2
N$3  (via drill 0.5)
  Top 0.254: U3.1 15.49,9.37 15.49,11.33 v15.82,11.66 | R2.2 7.07,3.47 v7.62,2.92
  Bottom 0.254: v15.82,11.66 15.88,11.71 15.88,17.14 15.24,17.78 14.35,17.78 13.46,16.89 9.65,16.89 6.6,13.84 6.6,3.94 v7.62,2.92
N$4
  Top 0.254: U3.5 14.92,4.29 R8.1
N$5
  Top 0.254: D1.A 46.42,17.4 45.4,18.41 R1.2
N$6
  Top 0.254: R10.2 46.7,4.57 D2.A
N$11
  Top 0.254: IC1.16 28.13,10.6 29.84,8.89 29.84,6.48 27.43,6.48 27.05,6.09 Y1.3
N$12
  Top 0.254: IC1.17 28.32,11.1 30.35,9.07 30.35,6.17 Y1.1
N$15
  Top 0.254: X3.D+ 6.1,11.43 6.35,11.18 6.35,9.45 6.92,8.88 R5.1
N$16
  Top 0.254: X3.D- 6.59,12.08 6.99,11.68 6.99,10.65 R4.1
RST  (via drill 0.5)
  Top 0.254: IC1.13 27.86,9.1 28.07,8.89 28.07,7.75 28.45,7.37 v28.83,7.37 | SW1.1 8.26,5.68 | 8.26,5.68 9.23,5.68 v9.27,5.71 11.36,5.71 SW1.3 | JP1.16 7.11,1.27 8.51,2.67 8.51,3.43 8.26,3.68 8.26,5.68
  Bottom 0.254: v9.27,5.71 9.27,6.22 8.38,7.11 8.38,9.53 10.54,11.68 13.97,11.68 14.86,10.79 16.51,10.79 17.91,12.19 17.91,17.27 18.8,18.16 21.59,18.16 24.38,15.37 28.07,15.37 28.07,10.67 29.84,8.89 29.84,7.87 29.34,7.37 v28.83,7.37
SCK  (via drill 0.5)
  Top 0.254: U1.4 40.06,13.77 v39.62,13.34 | JP1.6 30.99,1.27 29.72,2.54 27.94,2.54 27.43,3.05 25.65,3.05 25.22,3.48 IC1.9
  Bottom 0.254: v39.62,13.34 38.1,13.34 35.81,11.05 35.81,6.99 31.62,2.79 31.62,1.4 JP1.6
SWCLK  (via drill 0.5)
  Top 0.254: U1.36 41.46,8.56 v42.42,9.53
  Bottom 0.254: v42.42,9.53 TP1.P$1
VBAT  (via drill 0.5)
  Top 0.254: JP3.1 16.06,21.14 D4.A arc-90 15.93,18.8 15.62,18.8 15.24,18.41 12.32,18.41 v11.94,18.8 11.94,16.26 11.67,15.99 X1.2 11.67,12.87 C3.1 10.86,11.36 13.02,9.21 U3.3 | R3.1 29.44,17.78 v28.4,18.82
  Bottom 0.254: v11.94,18.8 16.64,18.8 17.14,19.3 18.16,19.3 18.67,18.8 22.1,18.8 22.48,19.18 23.11,19.18 23.62,18.67 23.62,17.78 25.02,16.38 28.07,16.38 28.4,16.71 v28.4,18.82
VBUS  (via drill 0.5)
  Top 0.254: IC1.7 24.22,6.9 24.51,6.6 24.51,5.33 23.18,4 21.78,4 v20.57,5.21 | CHG.A 1.14,5.59 0.51,6.22 0.51,8.76 1.02,9.27 1.02,12.95 1.27,13.21 3.56,13.21 4.06,12.7 5.19,12.7 X3.VBUS 6.83,12.73 7.55,12.01 C6.1 8.95,12.01 | 17.51,16.29 U2.1 | 17.51,16.29 17.53,16.28 17.53,14.48 v14.61,14.48 | JP3.3 21.59,20.76 D4.C R9.1 17.51,16.69 17.51,16.29 | v9.53,12.45 9.09,12.01 8.95,12.01 | 8.95,12.01 10.54,10.41 11.05,10.41 11.56,9.91 11.56,9.02 12.32,9.02 12.32,8.13 13.02,7.43 U3.4 13.02,6.16 13.84,5.33 v13.97,5.33
  Bottom 0.254: v13.97,5.33 14.22,5.08 20.45,5.08 v20.57,5.21 | v9.53,12.45 11.81,14.73 14.35,14.73 v14.61,14.48

### Text on the board
tPlace: 3 | 2 | BAT | En | USB | 13 | 12 | 11 | ~ | 10 | 9 | 6 | ~5 | SCL | SDA | ~ | #13 | ~ | Feather / Bluefruit | 32u4 | adafruit! | RST | CHG | RX | TX | A3 | A4 | A5 | SCK | MOSI | MISO | RST | 3V | ARf | GND | A0 | A1 | A2 | 0 | 1 | DFU
bPlace: 3 | 2 | 3.7/4.2V / LiPoly Batt / µUSB charge | 6 | ~ | 5 | SCL | SDA | BAT | En | USB | 13 | 12 | 11~ | 10~ | 9~ | Feather 32u4 / Bluefruit LE | Bluefruit LE Pins: | SPI (SCK,MOSI,MISO) | ATmega32u4 / 8MHz & 3.3V | 4 Reset,7 IRQ,8 CS | Reset | SWDIO | SWCLK | MOSI | MISO | RST | 3V | Ref | GND | A0 | A1 | A2 | A3 | A4 | A5 | SCK | RX | TX | GND | 0 | 1